# Altium project USB_PD_DVD.PrjPcb
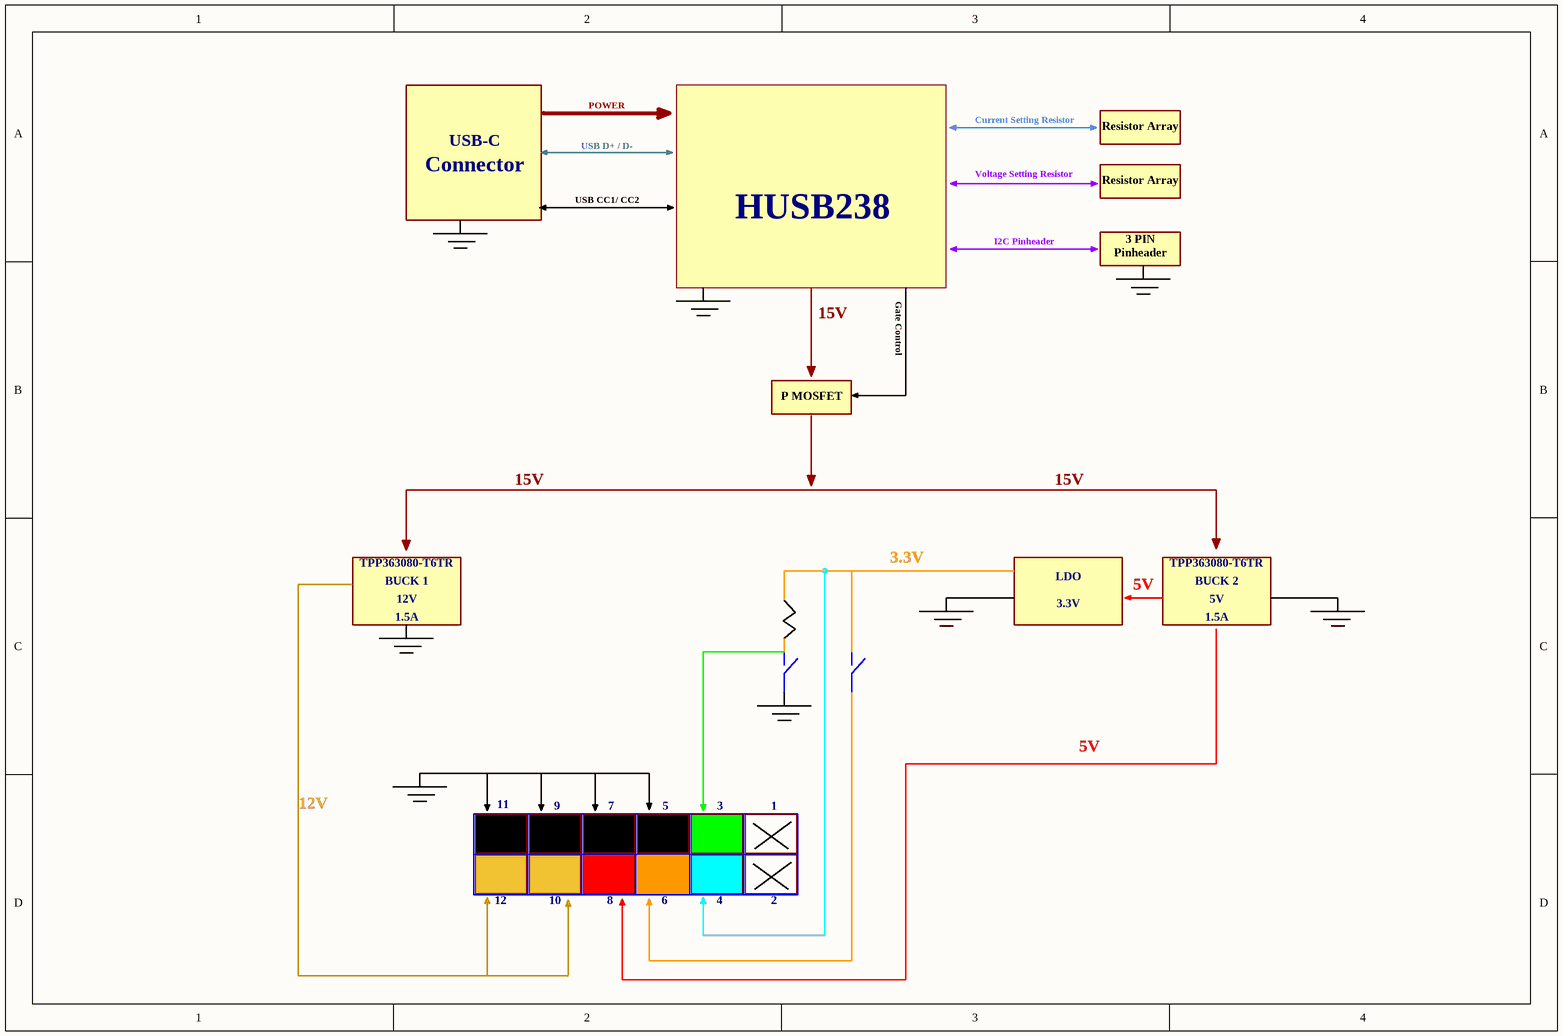
[diagram p0: Block_Diagram.SchDoc]
4 sheets, 91 parts. Net scope: global (net labels, ports and power ports of the same name join across sheets).
Board file: PD_dvd.PcbDoc
Sheets:
  Block_Diagram.SchDoc
  USB_PD.SchDoc
  Buck_Regulator.SchDoc
  CONNECTOR.SchDoc

## Sheet Block_Diagram.SchDoc
size A4; SheetNumber: 1; SheetTotal: 4

### Notes on the sheet
- POWER
- Connector
- USB-C
- USB D+ / D-
- Current Setting Resistor
- Voltage Setting Resistor
- Resistor Array
- USB CC1/ CC2
- HUSB238
- I2C Pinheader
- 3 PIN
- Gate Control
- Pinheader
- 15V
- P MOSFET
- TPP363080-T6TR
- BUCK 1
- 3.3V
- LDO
- BUCK 2
- 1.5A
- 12V
- 5V
- 11
- 9
- 7
- 5
- 3
- 1
- 12
- 10
- 8
- 6
- 4
- 2

## Sheet USB_PD.SchDoc
size A4; SheetNumber: 2; SheetTotal: 4
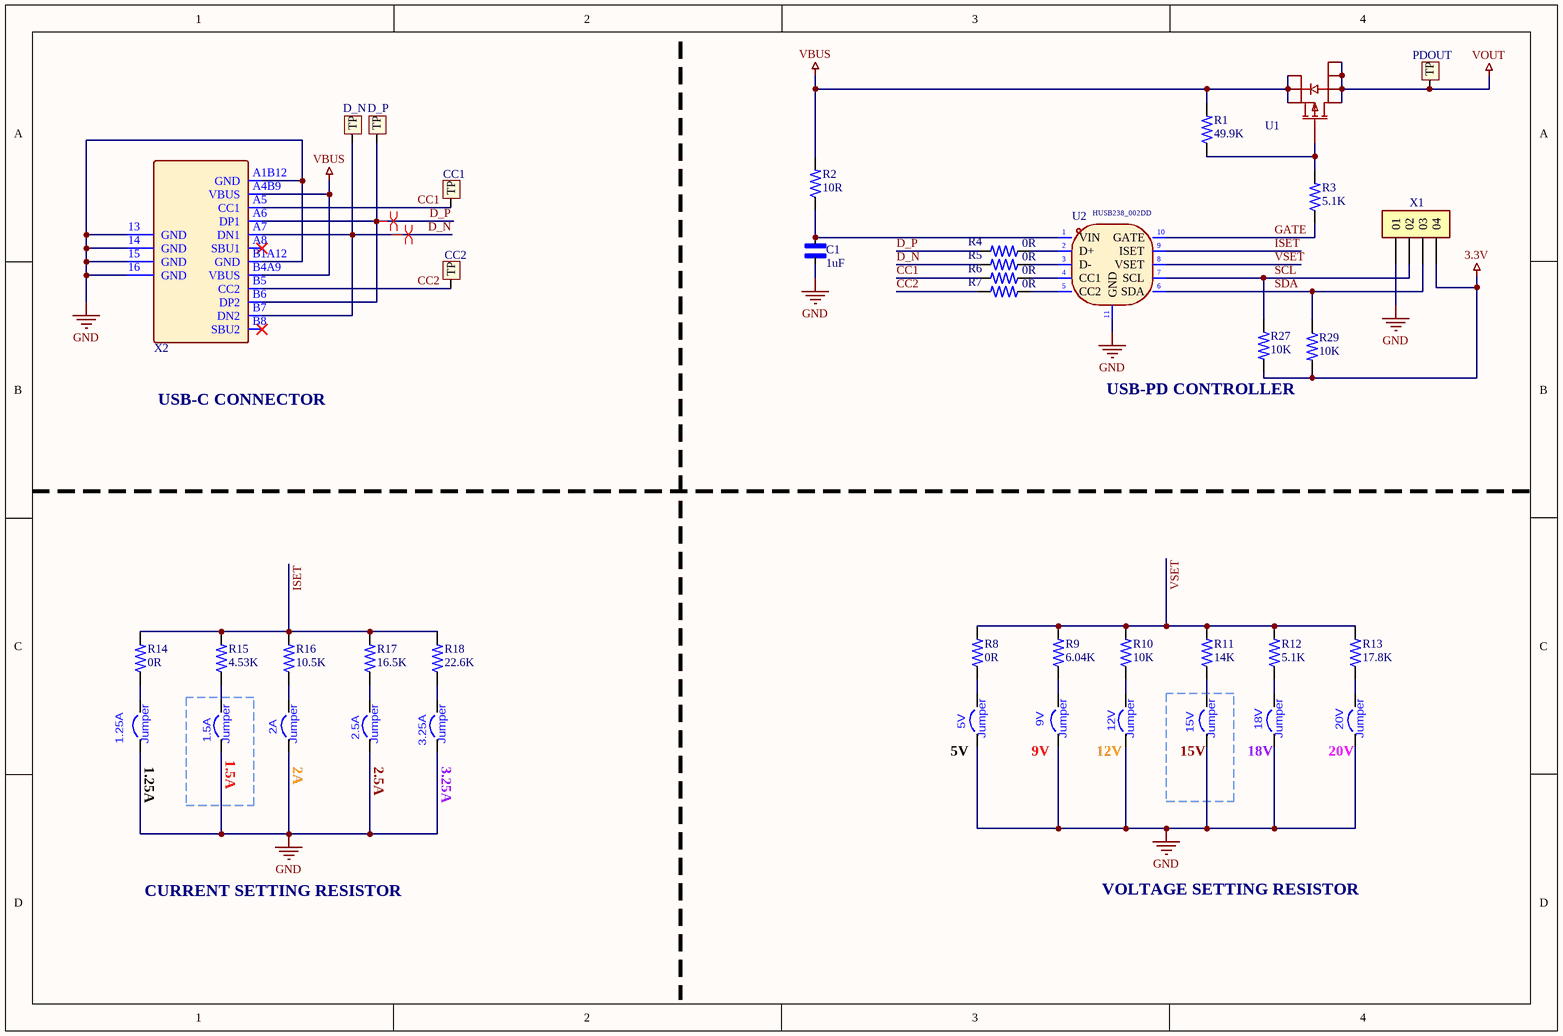
[diagram p1: USB_PD.SchDoc]

### Parts
1.5A  Jumper  [PAD-JUMPER-2-NC_BY_PASTE_YES_SILK]
1.25A  Jumper  [PAD-JUMPER-2-NC_BY_PASTE_YES_SILK]
2.5A  Jumper  [PAD-JUMPER-2-NC_BY_PASTE_YES_SILK]
2A  Jumper  [PAD-JUMPER-2-NC_BY_PASTE_YES_SILK]
3.25A  Jumper  [PAD-JUMPER-2-NC_BY_PASTE_YES_SILK]
5V  Jumper  [PAD-JUMPER-2-NC_BY_PASTE_YES_SILK]
9V  Jumper  [PAD-JUMPER-2-NC_BY_PASTE_YES_SILK]
12V  Jumper  [PAD-JUMPER-2-NC_BY_PASTE_YES_SILK]
15V  Jumper  [PAD-JUMPER-2-NC_BY_PASTE_YES_SILK]
18V  Jumper  [PAD-JUMPER-2-NC_BY_PASTE_YES_SILK]
20V  Jumper  [PAD-JUMPER-2-NC_BY_PASTE_YES_SILK]
C1  value 1uF  [CAP 0402]  (hidden comment: SMD capacitor)
CC1  TEST POINT  [TESTPOINT]  (value not drawn)
CC2  TEST POINT  [TESTPOINT]  (value not drawn)
D_N  TEST POINT  [TESTPOINT]  (value not drawn)
D_P  TEST POINT  [TESTPOINT]  (value not drawn)
PDOUT  TEST POINT  [TESTPOINT]  (value not drawn)
R1  value 49.9K  [RES_1206]  (hidden comment: SMD resistor)
R2  value 10R  [RES_0603]  (hidden comment: SMD resistor)
R3  value 5.1K  [RES_1206]  (hidden comment: SMD resistor)
R4  value 0R  [RES 0402]  (hidden comment: SMD resistor)
R5  value 0R  [RES 0402]  (hidden comment: SMD resistor)
R6  value 0R  [RES 0402]  (hidden comment: SMD resistor)
R7  value 0R  [RES 0402]  (hidden comment: SMD resistor)
R8  value 0R  [RES 0402]  (hidden comment: SMD resistor)
R9  value 6.04K  [RES 0402]  (hidden comment: SMD resistor)
R10  value 10K  [RES 0402]  (hidden comment: SMD resistor)
R11  value 14K  [RES 0402]  (hidden comment: SMD resistor)
R12  value 5.1K  [RES 0402]  (hidden comment: SMD resistor)
R13  value 17.8K  [RES 0402]  (hidden comment: SMD resistor)
R14  value 0R  [RES 0402]  (hidden comment: SMD resistor)
R15  value 4.53K  [RES 0402]  (hidden comment: SMD resistor)
R16  value 10.5K  [RES 0402]  (hidden comment: SMD resistor)
R17  value 16.5K  [RES 0402]  (hidden comment: SMD resistor)
R18  value 22.6K  [RES 0402]  (hidden comment: SMD resistor)
R27  value 10K  [RES 0402]  (hidden comment: SMD resistor NC)
R29  value 10K  [RES 0402]  (hidden comment: SMD resistor NC)
U1  P-Channel  MOSFET  [PRPAK-8_L3.0-W3.0-P0.65-BL-EP]  (value not drawn)
U2  value HUSB238_002DD  [DFN-10]  (hidden comment: USB-PD-IC)
X1  Header X 5  [SAMTEC_TS-104-T-A]  (value not drawn)
X2  USB-C connector  [USB-C-SMD_TYPEC-304J-BCP16]  (value not drawn)

### Blocks framed on the sheet
1.5A: 1.5A
15V: 15V

### Nets
3.3V: R27.2 R29.2 X1.04
GND: 1.5A.1 1.25A.1 2.5A.1 2A.1 3.25A.1 5V.1 9V.1 12V.1 15V.1 18V.1 20V.1 C1.2 U2.11(GND) X1.01 X2.13(GND) X2.14(GND) X2.15(GND) X2.16(GND) X2.A1B12(GND) X2.B1A12(GND)
VBUS: R1.2 R2.2 U1.1(S) U1.2(S) U1.3(S) X2.A4B9(VBUS) X2.B4A9(VBUS)
VOUT: PDOUT.1(TP) U1.5(D) U1.6(D) U1.7(D) U1.8(D)
CC1: CC1.1(TP) R6.2 X2.A5(CC1)
CC2: CC2.1(TP) R7.2 X2.B5(CC2)
D_N: D_N.1(TP) R5.2 X2.A7(DN1) X2.B7(DN2)
D_P: D_P.1(TP) R4.2 X2.A6(DP1) X2.B6(DP2)
GATE: R3.1 U2.10(GATE)
ISET: R14.2 R15.2 R16.2 R17.2 R18.2 U2.9(ISET)
SCL: R27.1 U2.7(SCL) X1.02
SDA: R29.1 U2.6(SDA) X1.03
VSET: R8.2 R9.2 R10.2 R11.2 R12.2 R13.2 U2.8(VSET)
Net1.5A_2: 1.5A.2 R15.1
Net1.25A_2: 1.25A.2 R14.1
Net2.5A_2: 2.5A.2 R17.1
Net2A_2: 2A.2 R16.1
Net3.25A_2: 3.25A.2 R18.1
Net5V_2: 5V.2 R8.1
Net9V_2: 9V.2 R9.1
Net12V_2: 12V.2 R10.1
Net15V_2: 15V.2 R11.1
Net18V_2: 18V.2 R12.1
Net20V_2: 20V.2 R13.1
NetC1_1: C1.1 R2.1 U2.1(VIN)
NetR1_1: R1.1 R3.2 U1.4(G)
NetR4_1: R4.1 U2.2(D+)
NetR5_1: R5.1 U2.3(D-)
NetR6_1: R6.1 U2.4(CC1)
NetR7_1: R7.1 U2.5(CC2)

Not connected (* = marked no-connect by the designer): X2 A8(SBU1)* B8(SBU2)*

### Layout directives
differential pair; differential pair class USB: D_N, D_P

### Notes on the sheet
- USB-C CONNECTOR
- (near R27) USB-PD CONTROLLER
- (near 1.25A) 1.25A
- (near 2A) 2A
- (near 2.5A) 2.5A
- (near 3.25A) 3.25A
- (near 5V) 5V
- (near 9V) 9V
- (near 12V) 12V
- (near 18V) 18V
- (near 20V) 20V
- CURRENT SETTING RESISTOR
- VOLTAGE SETTING RESISTOR

### Library data of the parts
1.5A 1.25A 2.5A 2A 3.25A 5V 9V 12V 15V 18V 20V = JUMPER SOLDER BRIDGE: SMD JUMPER
C1 = CAP_SMD_CERAMIC: Voltage: 50V; Tolerance: ±10%; Package: 0603; Price: *; JLCPCB Part #: *
R1-R18 R27 R29 = RES_SMD_CERAMIC: Tolerance: ±5%; Price: *; JLCPCB Part #: *
  R1-R3: Package: 0603
  R4-R18 R27 R29: Package: 0402
U1 = AONR21307: 30V 24A 9.2mΩ@10V 1.8V@250uA 1 P-Channel DFN-8(3x3) MOSFETs ROHS; Manifacturing Company Name: AOS; Manifacturing Part Number: AONR21307; Data Sheet: https://www.lcsc.com/datasheet/C3277813.pdf; Package: DFN-8(3x3); Price: *; Tolerance: N/A; JLCPCB Part #: C3277813
U2 = USB_PD_HUSB238: DFN-10L(3x3) USB Converters ROHS; Manifacturing Company Name: Hynetek; Manifacturing Part Number: HUSB238_002DD; Data Sheet: https://www.lcsc.com/datasheet/C7471904.pdf; Package: DFN-10L(3x3); Price: *; Tolerance: N/A; JLCPCB Part #: C7471904
X1 = 4 Pin Header: 4 pin header pitch 2.54mm; Manifacturing Part Number: C91552; Manifacturing Company Name: BOOMELE(Boom Precision Elec); Data Sheet: https://datasheet.lcsc.com/lcsc/2304140030_BOOMELE-Boom-Precision-Elec-C91552_C91552.pdf; Package: THT P 2.54mm; Price: *; Tolerance: N/A; JLCPCB Part #: C91552
X2 = TYPEC-304J-BCP16: 5A USB 3.1 1 Surface Mount, Right Angle 16P Female -40℃~+85℃ Type-C SMD USB Connectors ROHS; Manifacturing Company Name: XUNPU; Manifacturing Part Number: TYPEC-304J-BCP16; Data Sheet: https://www.lcsc.com/datasheet/C2835315.pdf; Package: SMD; Price: *; Tolerance: N/A; JLCPCB Part #: C2835315

## Sheet Buck_Regulator.SchDoc
size A4; SheetNumber: 3; SheetTotal: 4
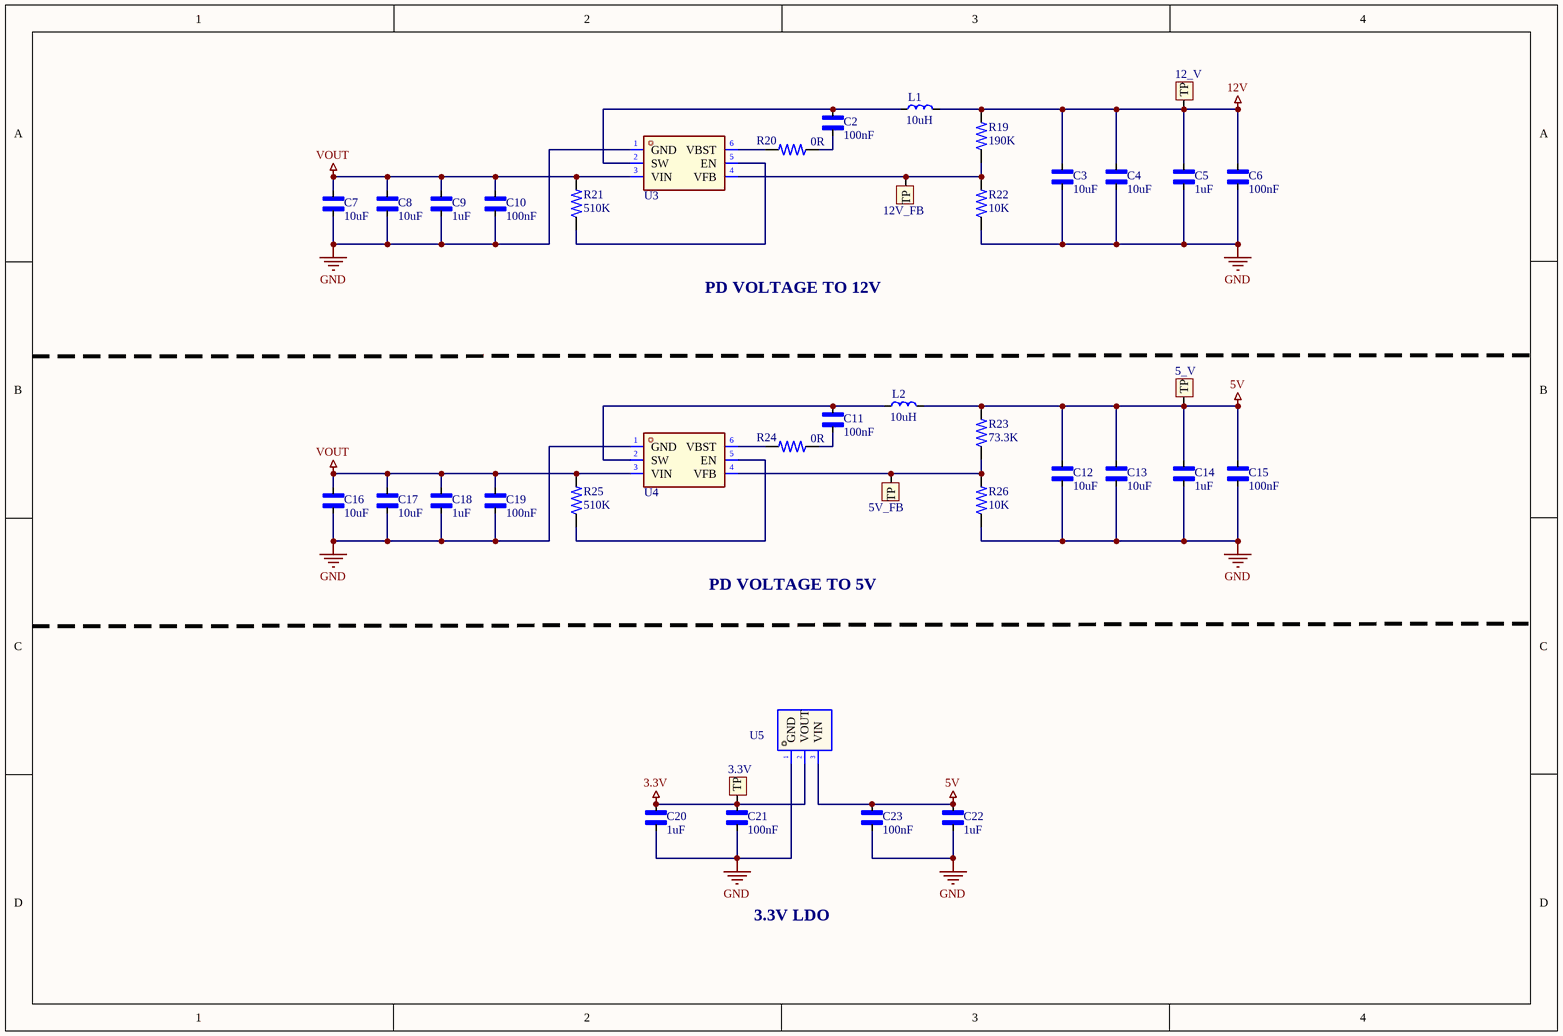
[diagram p2: Buck_Regulator.SchDoc]

### Parts
3.3V  TEST POINT  [TESTPOINT]  (value not drawn)
5_V  TEST POINT  [TESTPOINT]  (value not drawn)
5V_FB  TEST POINT  [TESTPOINT]  (value not drawn)
12_V  TEST POINT  [TESTPOINT]  (value not drawn)
12V_FB  TEST POINT  [TESTPOINT]  (value not drawn)
C2  value 100nF  [CAP 0402]  (hidden comment: SMD capacitor)
C3  value 10uF  [CAP_0805]  (hidden comment: SMD capacitor)
C4  value 10uF  [CAP_0805]  (hidden comment: SMD capacitor)
C5  value 1uF  [CAP 0402]  (hidden comment: SMD capacitor)
C6  value 100nF  [CAP 0402]  (hidden comment: SMD capacitor)
C7  value 10uF  [CAP_0805]  (hidden comment: SMD capacitor)
C8  value 10uF  [CAP_0805]  (hidden comment: SMD capacitor)
C9  value 1uF  [CAP 0402]  (hidden comment: SMD capacitor)
C10  value 100nF  [CAP 0402]  (hidden comment: SMD capacitor)
C11  value 100nF  [CAP 0402]  (hidden comment: SMD capacitor)
C12  value 10uF  [CAP_0805]  (hidden comment: SMD capacitor)
C13  value 10uF  [CAP_0805]  (hidden comment: SMD capacitor)
C14  value 1uF  [CAP 0402]  (hidden comment: SMD capacitor)
C15  value 100nF  [CAP 0402]  (hidden comment: SMD capacitor)
C16  value 10uF  [CAP_0805]  (hidden comment: SMD capacitor)
C17  value 10uF  [CAP_0805]  (hidden comment: SMD capacitor)
C18  value 1uF  [CAP 0402]  (hidden comment: SMD capacitor)
C19  value 100nF  [CAP 0402]  (hidden comment: SMD capacitor)
C20  value 1uF  [CAP 0402]  (hidden comment: SMD capacitor)
C21  value 100nF  [CAP 0402]  (hidden comment: SMD capacitor)
C22  value 1uF  [CAP 0402]  (hidden comment: SMD capacitor)
C23  value 100nF  [CAP 0402]  (hidden comment: SMD capacitor)
L1  value 10uH  [INDP7166X50N]  (hidden comment: POWER INDUCTOR)
L2  value 10uH  [INDP7166X50N]  (hidden comment: POWER INDUCTOR)
R19  value 190K  [RES 0402]  (hidden comment: SMD resistor)
R20  value 0R  [RES 0402]  (hidden comment: SMD resistor)
R21  value 510K  [RES 0402]  (hidden comment: SMD resistor)
R22  value 10K  [RES 0402]  (hidden comment: SMD resistor)
R23  value 73.3K  [RES 0402]  (hidden comment: SMD resistor)
R24  value 0R  [RES 0402]  (hidden comment: SMD resistor)
R25  value 510K  [RES 0402]  (hidden comment: SMD resistor)
R26  value 10K  [RES 0402]  (hidden comment: SMD resistor)
U3  Buck IC  [SOT-23-6_L2.9-W1.6-P0.95-LS2.8-BR]  (value not drawn)
U4  Buck IC  [SOT-23-6_L2.9-W1.6-P0.95-LS2.8-BR]  (value not drawn)
U5  3.3V LDO  [SOT-89-3_L4.5-W2.5-P1.50-LS4.1-BR]  (value not drawn)

### Nets
3.3V: 3.3V.1(TP) C20.1 C21.1 U5.2(VOUT)
5V: 5_V.1(TP) C12.1 C13.1 C14.1 C15.1 C22.1 C23.1 L2.2 R23.2 U5.3(VIN)
12V: 12_V.1(TP) C3.1 C4.1 C5.1 C6.1 L1.2 R19.2
GND: C3.2 C4.2 C5.2 C6.2 C7.2 C8.2 C9.2 C10.2 C12.2 C13.2 C14.2 C15.2 C16.2 C17.2 C18.2 C19.2 C20.2 C21.2 C22.2 C23.2 R22.1 R26.1 U3.1(GND) U4.1(GND) U5.1(GND)
VOUT: C7.1 C8.1 C9.1 C10.1 C16.1 C17.1 C18.1 C19.1 R21.2 R25.2 U3.3(VIN) U4.3(VIN)
Net5V_FB_1: 5V_FB.1(TP) R23.1 R26.2 U4.4(VFB)
Net12V_FB_1: 12V_FB.1(TP) R19.1 R22.2 U3.4(VFB)
NetC2_1: C2.1 L1.1 U3.2(SW)
NetC2_2: C2.2 R20.1
NetC11_1: C11.1 L2.1 U4.2(SW)
NetC11_2: C11.2 R24.1
NetR20_2: R20.2 U3.6(VBST)
NetR21_1: R21.1 U3.5(EN)
NetR24_2: R24.2 U4.6(VBST)
NetR25_1: R25.1 U4.5(EN)

### Notes on the sheet
- PD VOLTAGE TO 12V
- PD VOLTAGE TO 5V
- 3.3V LDO

### Library data of the parts
C2-C23 = CAP_SMD_CERAMIC: Voltage: 50V; Tolerance: ±10%; Price: *; JLCPCB Part #: *
  C2 C5 C6 C9-C11 C14 C15 C18-C23: Package: 0603
  C3 C4 C7 C8 C12 C13 C16 C17: Package: 0805
L1 L2 = PSPMAA0605H-100M-ANP: FIXED IND 10uH 4.5A 57mΩ SMD,6.6x7.1mm; Manifacturing Company Name: PROD Tech; Manifacturing Part Number: PSPMAA0605H-100M-ANP; Data Sheet: https://www.lcsc.com/datasheet/C2983092.pdf; Package: SMD,6.6x7.1mm; Price: *
R19-R26 = RES_SMD_CERAMIC: Tolerance: ±5%; Package: 0402; Price: *; JLCPCB Part #: *
U3 U4 = TPP363080-T6TR: Buck Adjustable 4.5V~36V 3A TSOT-23-6 DC-DC Converters ROHS; Manifacturing Company Name: 3PEAK; Manifacturing Part Number: TPP363080-T6TR; Data Sheet: https://www.lcsc.com/datasheet/C18236275.pdf; Package: TSOT-23-6; Price: *; Tolerance: N/A; JLCPCB Part #: C18236275
U5 = AMS1117S-3.3: 70dB@(120Hz) 1A Fixed 3.3V Positive 30V SOT-89-3 Voltage Regulators - Linear, Low Drop Out (LDO) Regulators ROHS; Manifacturing Company Name: JSMSEMI; Manifacturing Part Number: AMS1117S-3.3; Data Sheet: https://www.lcsc.com/datasheet/C917152.pdf; Package: SOT-89-3; Price: *; Tolerance: N/A; JLCPCB Part #: JSMSEMI; Value: *

## Sheet CONNECTOR.SchDoc
size A4; SheetNumber: 4; SheetTotal: 4
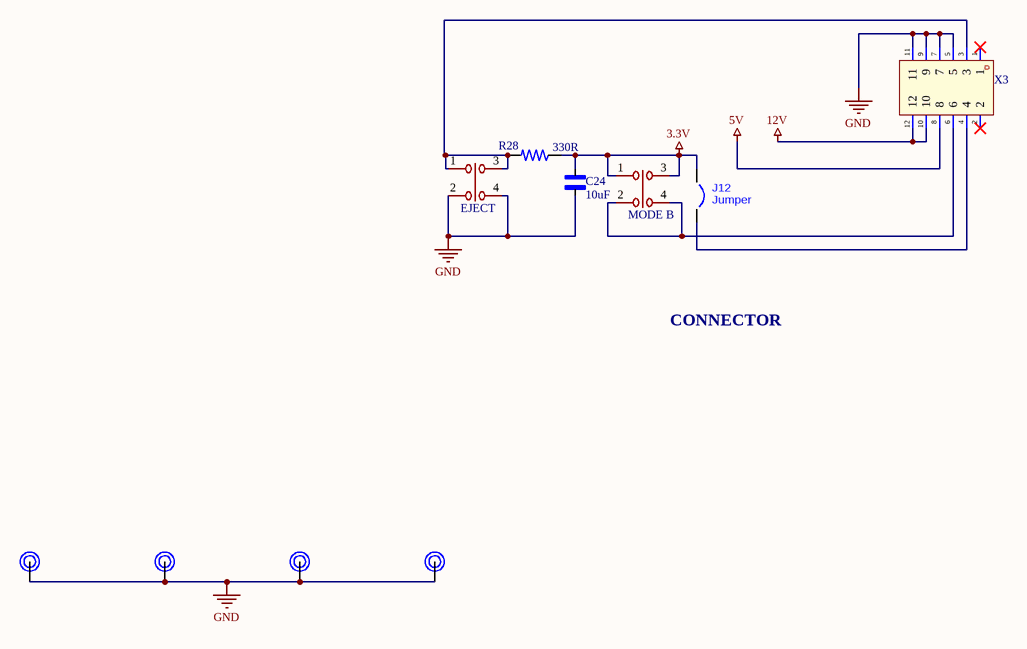
[diagram p3: CONNECTOR.SchDoc]

### Parts
C24  value 10uF  [CAP_0805]  (hidden comment: SMD capacitor)
EJECT  THT Button  [SW-TH_BTSA-X-P-11]  (value not drawn)
J12  Jumper  [PAD-JUMPER-2-NC_BY_PASTE_YES_SILK]
MODE_B  THT Button  [SW-TH_BTSA-X-P-11]  (value not drawn)
R28  value 330R  [RES_0603]  (hidden comment: SMD resistor)
SCREW_1  Screw Hole  [PCB hole]  (value not drawn)
SCREW_2  Screw Hole  [PCB hole]  (value not drawn)
SCREW_3  Screw Hole  [PCB hole]  (value not drawn)
SCREW_4  Screw Hole  [PCB hole]  (value not drawn)
X3  Connector  [CONN-TH_S12B-PHDSS-B-LF-SN]  (value not drawn)

### Nets
3.3V: C24.1 J12.1 MODE_B.1 MODE_B.3 R28.1
5V: X3.8
12V: X3.10 X3.12
GND: C24.2 EJECT.2 EJECT.4 SCREW_1.1 SCREW_2.1 SCREW_3.1 SCREW_4.1 X3.5 X3.7 X3.9 X3.11
NetEJECT_1: EJECT.1 EJECT.3 R28.2 X3.3
NetJ12_2: J12.2 X3.4
NetMODE_B_2: MODE_B.2 MODE_B.4 X3.6

Not connected (* = marked no-connect by the designer): X3 1* 2*

### Notes on the sheet
- CONNECTOR

### Library data of the parts
C24 = CAP_SMD_CERAMIC: Voltage: 50V; Tolerance: ±10%; Package: 0805; Price: *; JLCPCB Part #: *
EJECT MODE_B = BTSA-L-P-11: Latching Through Hole 10,000 Cycles Without 2.5N 50mA Through Hole Pushbutton Switches ROHS; Manifacturing Company Name: ROCPU Switches; Manifacturing Part Number: BTSA-L-P-11; Data Sheet: https://www.lcsc.com/datasheet/C2693635.pdf; Package: THT; Price: N/A; Tolerance: N/A; JLCPCB Part #: C2693635; Value: N/A
J12 = JUMPER SOLDER BRIDGE: SMD JUMPER
R28 = RES_SMD_CERAMIC: Tolerance: ±5%; Package: 0603; Price: *; JLCPCB Part #: *
X3 = S12B-PHDSS-B(LF)(SN): 2x6P 12P PHD Tin 2mm 6 -25℃~+85℃ 3A 2 2mm Copper Alloy Right Angle Through Hole,Right Angle,P=2mm Wire To Board Connector ROHS; Manifacturing Company Name: JST; Tolerance: ±5%; Manifacturing Part Number: S12B-PHDSS-B(LF)(SN); Data Sheet: https://www.lcsc.com/datasheet/C493114.pdf; Package: Through Hole,Right Angle,P=2mm; Price: *; JLCPCB Part #: C493114

## Nets that join several sheets
3.3V: USB_PD (R27.2 R29.2 X1.04), Buck_Regulator (3.3V.1 C20.1 C21.1 U5.2), CONNECTOR (5 pins)
5V: Buck_Regulator (10 pins), CONNECTOR (X3.8)
12V: Buck_Regulator (7 pins), CONNECTOR (X3.10 X3.12)
GND: USB_PD (20 pins), Buck_Regulator (25 pins), CONNECTOR (11 pins)
VOUT: USB_PD (5 pins), Buck_Regulator (12 pins)